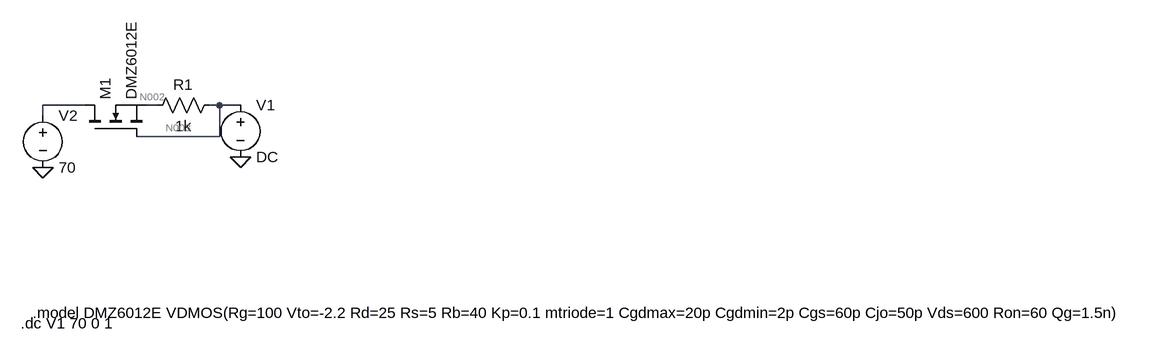
[diagram p0: schematic Draft4.asc]
Draft4.asc, the LTspice schematic file:
Version 4
SHEET 1 1392 680
WIRE 160 -128 96 -128
WIRE 272 -128 256 -128
WIRE 368 -128 352 -128
WIRE 400 -128 368 -128
WIRE 96 -112 96 -128
WIRE 368 -80 368 -128
WIRE 368 -80 240 -80
FLAG 400 -48 0
FLAG 96 -32 0
SYMBOL nmos 160 -80 R270
SYMATTR InstName M1
SYMATTR Value DMZ6012E
SYMBOL res 368 -144 R90
WINDOW 0 0 56 VBottom 2
WINDOW 3 32 56 VTop 2
SYMATTR InstName R1
SYMATTR Value 1k
SYMBOL voltage 400 -144 R0
WINDOW 123 0 0 Left 0
WINDOW 39 0 0 Left 0
SYMATTR InstName V1
SYMATTR Value DC
SYMBOL voltage 96 -128 R0
WINDOW 123 0 0 Left 0
WINDOW 39 0 0 Left 0
SYMATTR InstName V2
SYMATTR Value 70
TEXT 80 192 Left 2 !.model DMZ6012E VDMOS(Rg=100 Vto=-2.2 Rd=25 Rs=5 Rb=40 Kp=0.1 mtriode=1 Cgdmax=20p Cgdmin=2p Cgs=60p Cjo=50p Vds=600 Ron=60 Qg=1.5n)
TEXT 62 208 Left 2 !.dc V1 70 0 1

The netlist it stands for:
* Draft4.asc
M1 N001 N003 N002 N002 DMZ6012E
R1 N003 N002 1k
V1 N003 0 DC
V2 N001 0 70
.model NMOS NMOS
.model PMOS PMOS
.lib standard.mos
.model DMZ6012E VDMOS(Rg=100 Vto=-2.2 Rd=25 Rs=5 Rb=40 Kp=0.1 mtriode=1 Cgdmax=20p Cgdmin=2p Cgs=60p Cjo=50p Vds=600 Ron=60 Qg=1.5n)
.dc V1 70 0 1
.backanno
.end

* Results of the author's LTspice run, read from the files saved beside the schematic
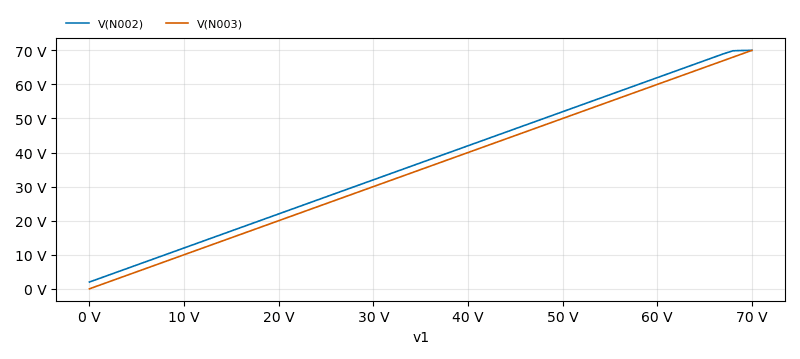
[diagram p1: DC transfer characteristic of Draft4.asc, plotted from the saved traces]
* DC transfer characteristic, 1 run:
*   V(N002): 70 V at v1=70 V, 1.991 V at v1=0 V, min 1.991 V, max 70 V
*   V(N003): 70 V at v1=70 V, 0 V at v1=0 V, min 0 V, max 70 V